# Altium schematic sheet LM317.SchDoc
size A4; SheetNumber: 1; SheetTotal: 1
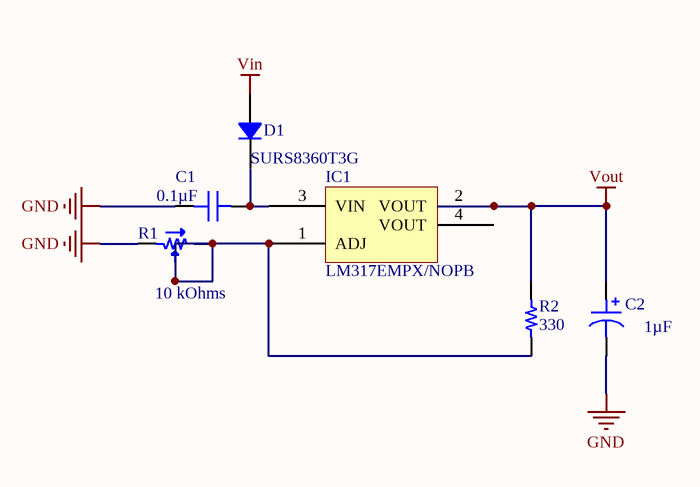
[diagram p0: LM317.SchDoc]

## Parts
C1  0.1µF  [CAP 0805_2012]
C2  1µF  [CAP ALSMD 4.3MM H5.4MM]
D1  SURS8360T3G  [DO214AB SMC]
IC1  LM317EMPX/NOPB  [TI SOT-223 DCY]
R1  10 kOhms  [POT BOURNS TRIMPOT TC33]
R2  330  [RES 0805_2012]

## Nets
GND: C1.1 C2.2 R1.1
Vin: D1.1
Vout: C2.1 IC1.2(VOUT) R2.2
NetC1_2: C1.2 D1.2 IC1.3(VIN)
NetIC1_1: IC1.1(ADJ) R1.2 R1.3 R2.1

Not connected (* = marked no-connect by the designer): IC1 4(VOUT)

## Library data of the parts
C1 = CC0805MRX7R9BB104: CAP CER 0.1UF 50V X7R 0805; Manufacturer: Yageo; Tolerance: ±20%; Part Number: CC0805MRX7R9BB104; Value: 0.1µF; Applications: General Purpose; Capacitance: 0.1µF; ComponentLink1Description: Datasheet; ComponentLink1URL: https://www.yageo.com/upload/media/product/productsearch/datasheet/mlcc/UPY-GPHC_X7R_6.3V-to-50V_18.pdf; ComponentLink2Description: DigiKey Link; ComponentLink2URL: http://digikey.com/product-detail/en/yageo/CC0805MRX7R9BB104/311-4351-1-ND/8025440; Device Package: 0805 (2012 Metric); LastUpdated: 2.9.2020 01:04:42; Lifecycle Status: Active; Minimum Order: 1; Mounting Type: Surface Mount, MLCC; Operating Temperature: -55°C ~ 125°C; Package / Case: 0805 (2012 Metric); Packaging: TapeAndReel; PartId: 2475; Part Status: Active; Price: 0.02; Series: CC; Size / Dimension: 0.079" L x 0.049" W (2.00mm x 1.25mm); Supplier 1: DigiKey; Supplier Part Number 1: 311-4351-1-ND; Temperature Coefficient: X7R; Thickness (Max): 0.037" (0.95mm); Voltage - Rated: 50V
C2 = UZT1H010MCL1GB: CAP ALUM 1UF 20% 50V SMD; Manufacturer: Nichicon; Lifetime @ Temp.: 1000 Hrs @ 105°C; Ripple Current @ High Frequency: 8.1mA @ 10kHz; Ripple Current @ Low Frequency: 5.4mA @ 120Hz; Surface Mount Land Size: 0.169" L x 0.169" W (4.30mm x 4.30mm); Part Number: UZT1H010MCL1GB; Applications: General Purpose; Capacitance: 1µF; ComponentLink1Description: Datasheet; ComponentLink1URL: http://nichicon-us.com/english/products/pdfs/e-uzt.pdf; ComponentLink2Description: DigiKey Link; ComponentLink2URL: http://digikey.com/product-detail/en/nichicon/UZT1H010MCL1GB/493-10179-1-ND/3984024; Device Package: Radial, Can - SMD; Height - Seated (Max): 0.181" (4.60mm); LastUpdated: 2.9.2020 01:18:27; Lifecycle Status: Active; Minimum Order: 1; Mounting Type: Surface Mount; Operating Temperature: -40°C ~ 105°C; Package / Case: Radial, Can - SMD; Packaging: TapeAndReel; PartId: 8521; Part Status: Active; Price: 0.17; Series: UZT; Size / Dimension: 0.157" Dia (4.00mm); Supplier 1: DigiKey; Supplier Part Number 1: 493-10179-1-ND; Tolerance: ±20%; Value: 1µF; Voltage - Rated: 50V
D1 = SURS8360T3G: DIODE GEN PURP 600V 3A SMC; Manufacturer: ON Semiconductor; Current - Reverse Leakage @ Vr: 10µA @ 600V; Diode Type: Standard; Reverse Recovery Time (trr): 75ns; Speed: Fast Recovery =< 500ns, > 200mA (Io); Voltage - Forward (Vf) (Max) @ If: 1.25V @ 3A; Part Number: SURS8360T3G; ComponentLink1Description: Datasheet; ComponentLink1URL: http://www.onsemi.com/pub/Collateral/MURS320T3-D.PDF; ComponentLink2Description: DigiKey Link; ComponentLink2URL: http://digikey.com/product-detail/en/on-semiconductor/SURS8360T3G/SURS8360T3GOSCT-ND/9087771; Current - Average Rectified (Io): 3A; LastUpdated: 2.9.2020 01:18:57; Lifecycle Status: Active; Minimum Order: 1; Mounting Type: Surface Mount; Operating Temperature - Junction: -65°C ~ 175°C; Package / Case: DO-214AB, SMC; Packaging: TapeAndReel; PartId: 348; Part Status: Active; Price: 0.30; Series: -; Supplier 1: DigiKey; Supplier Part Number 1: SURS8360T3GOSCT-ND; Supplier Device Package: SMC; Voltage - DC Reverse (Vr) (Max): 600V
IC1 = LM317EMPX/NOPB: IC REG LIN POS ADJ 1.5A SOT223-4; Manufacturer: Texas Instruments; Number of Regulators: 1; Output Configuration: Positive; Output Type: Adjustable; Protection Features: Over Current, Over Temperature, Short Circuit; PSRR: 80dB ~ 65dB (120Hz); Voltage - Input (Max): 37V; Voltage - Output (Min/Fixed): 1.25V; Part Number: LM317EMPX/NOPB; ComponentLink1Description: Datasheet; ComponentLink1URL: http://www.ti.com/general/docs/suppproductinfo.tsp?distId=10&gotoUrl=http%3A%2F%2Fwww.ti.com%2Flit%2Fgpn%2Flm117; ComponentLink2Description: DigiKey Link; ComponentLink2URL: //digikey.com/product-detail/en/texas-instruments/LM317EMPX-NOPB/LM317EMPX-NOPBTR-ND/367000; Current - Output: 1.5A; Device Package: TO-261-4, TO-261AA; LastUpdated: 9.12.2019 14:53:58; Lifecycle Status: 0; Minimum Order: 1; Mounting Type: Surface Mount; Operating Temperature: 0°C ~ 125°C; Package / Case: TO-261-4, TO-261AA; Packaging: TapeAndReel; Part Status: Active; Price: 0.50; Series: -; Supplier 1: DigiKey; Supplier Part Number 1: LM317EMPX/NOPBTR-ND; Supplier Device Package: SOT-223-4; Voltage - Output (Max): 37V
R1 = TC33X-2-103G: TRIMMER 10K OHM 0.1W J LEAD TOP; Manufacturer: Bourns Inc.; Adjustment Type: Top Adjustment; Number of Turns: 1; Power (Watts): 0.1W, 1/10W; Resistive Material: Cermet; Temperature Coefficient: ±250ppm/°C; Tolerance: ±25%; Part Number: TC33X-2-103G; ComponentLink1Description: Datasheet; ComponentLink1URL: https://www.bourns.com/docs/Product-Datasheets/TC33.pdf; ComponentLink2Description: DigiKey Link; ComponentLink2URL: http://digikey.com/product-detail/en/bourns-inc/TC33X-2-103G/TC33X-2-103G-ND/2566880; LastUpdated: 30.8.2020 21:01:57; Lifecycle Status: Active; Minimum Order: 9000; Mounting Type: Surface Mount; Packaging: TapeAndReel; PartId: 68; Price: 0.13; Resistance: 10 kOhms; Series: Trimpot® TC33 - Open Frame; Size / Dimension: Rectangular - 0.150" x 0.142" Face x 0.047" H (3.80mm x 3.60mm x 1.20mm); Supplier 1: DigiKey; Supplier Part Number 1: TC33X-2-103G-ND; Termination Style: J Lead; Value: 10 kOhms
R2 = TNPW0805330RDEEA: RES 330 OHM 0.5% 1/8W 0805; Manufacturer: Vishay Dale; Power (Watts): 0.2W, 1/5W; Resistance: 330 Ohms; Temperature Coefficient: ±25ppm/°C; Part Number: TNPW0805330RDEEA; Value: 330; ComponentLink1Description: Datasheet; ComponentLink1URL: http://www.vishay.com/docs/28758/tnpw_e3.pdf; ComponentLink2Description: DigiKey Link; ComponentLink2URL: http://digikey.com/product-detail/en/vishay-dale/TNPW0805330RDEEA/541-3919-1-ND/7355277; Composition: Thin Film; Device Package: 0805 (2012 Metric); Features: Anti-Sulfur, Automotive AEC-Q200, Moisture Resistant; Height - Seated (Max): 0.022" (0.55mm); LastUpdated: 2.9.2020 01:14:55; Lifecycle Status: Active; Minimum Order: 1; Number of Terminations: 2; Operating Temperature: -55°C ~ 155°C; Package / Case: 0805 (2012 Metric); Packaging: TapeAndReel; PartId: 40812; Part Status: Active; Price: 0.05; Ratings: AEC-Q200; Series: TNPW e3; Size / Dimension: 0.079" L x 0.049" W (2.00mm x 1.25mm); Supplier 1: DigiKey; Supplier Part Number 1: 541-3919-1-ND; Supplier Device Package: 0805; Tolerance: ±0.5%